# EAGLE design DCCInterface (EAGLE 9.6.2)
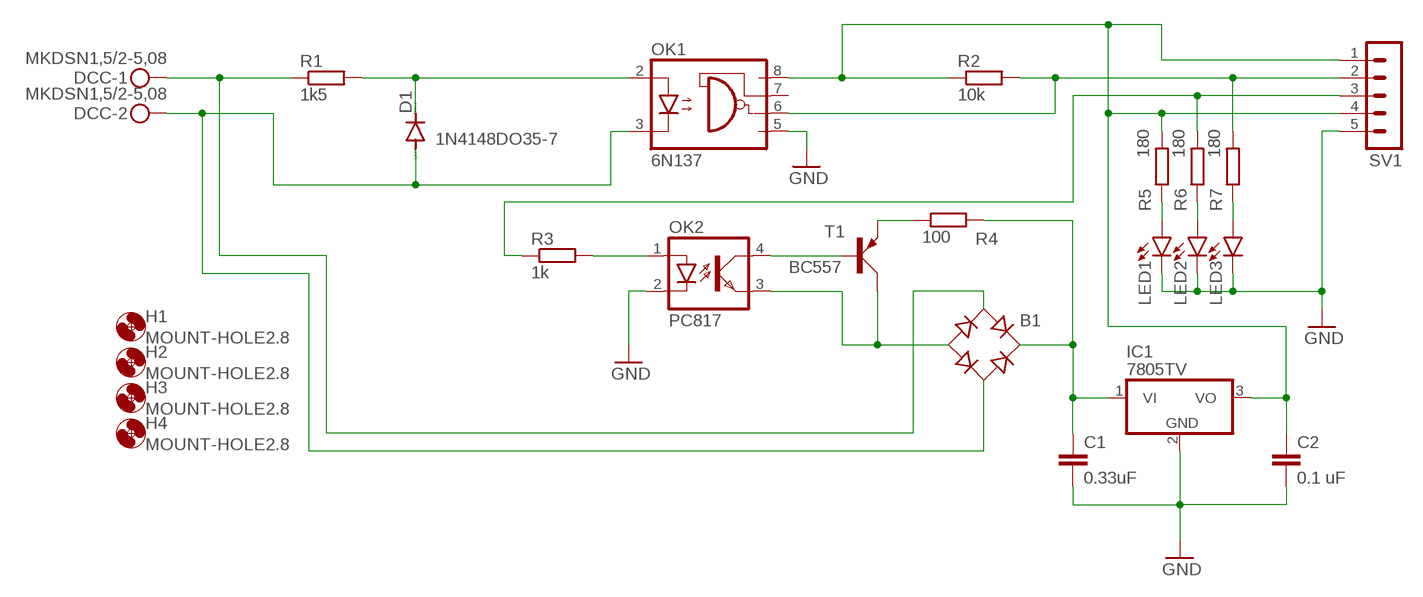
[diagram p0: schematic, sheet 1]

## Parts
B1  RB1A  [RB1A]
C1  0.33uF  C-EU025-025X050  [C025-025X050]
C2  0.1 uF  C-EU025-025X050  [C025-025X050]
D1  1N4148DO35-7  [DO35-7]
DCC  MKDSN1,5/2-5,08  [MKDSN1,5/2-5,08]
H1  MOUNT-HOLE2.8  [2,8]
H2  MOUNT-HOLE2.8  [2,8]
H3  MOUNT-HOLE2.8  [2,8]
H4  MOUNT-HOLE2.8  [2,8]
IC1  7805TV  [TO220V]
LED1  LED3MM  [LED3MM]
LED2  LED3MM  [LED3MM]
LED3  LED3MM  [LED3MM]
OK1  6N137  [DIL08]
OK2  PC817  [DIL04]
R1  1k5  R-EU_0204/7  [0204/7]
R2  10k  R-EU_0204/7  [0204/7]
R3  1k  R-EU_0204/7  [0204/7]
R4  100  R-EU_0204/7  [0204/7]
R5  180  R-EU_0204/7  [0204/7]
R6  180  R-EU_0204/7  [0204/7]
R7  180  R-EU_0204/7  [0204/7]
SV1  MA05-1  [MA05-1]
T1  BC557  [SOT54A]

## Nets
GND: C1.2 C2.2 IC1.2(GND) LED1.K(C) LED2.K(C) LED3.K(C) OK1.5(GND) OK2.2(C) SV1.5
N$1: LED1.A R5.1
N$2: C2.1 IC1.3(VO) OK1.8(VCC) R2.1 R5.2 SV1.1 SV1.4
N$3: D1.C OK1.2(A) R1.2
N$4: LED2.A R6.1
N$5: OK1.6(VO) R2.2 R7.2 SV1.2
N$6: B1.AC1 DCC.1 R1.1
N$7: OK2.1(A) R3.2
N$8: OK2.4(COL) T1.B
N$9: B1.+ C1.1 IC1.1(VI) R4.2
N$10: B1.- OK2.3(EMIT) T1.C
N$11: R4.1 T1.E
N$12: R3.1 R6.2 SV1.3
N$13: B1.AC2 D1.A DCC.2 OK1.3(C)
N$14: LED3.A R7.1
Unconnected: OK1.7(VE)

## Library data of the parts
B1 = rectifier:RB1A: RECTIFIER 1 A
C1 C2 = rcl:C-EU: CAPACITOR, European symbol; SPICEPREFIX: C
D1 = diode:1N4148: DIODE high speed (Philips)
DCC = con-phoenix-508:MKDSN1,5/2-5,08: MKDSN 1,5/ 2-5,08 Printklemme Nennstrom: 13,5 A Nennspannung: 250 V Rastermaß: 5,08 mm Polzahl: 2 Anschlussart: Schraubanschluss Montage: Löten Anschlussrichtung Leiter/Platine: 0 ° Artikelnummer: 1729128 Source: http://eshop.phoenixcontact.com .. 1729128.pdf
H1-H4 = holes:MOUNT-HOLE: MOUNTING HOLE with drill center marker
IC1 = linear:78*: Positive VOLTAGE REGULATOR Source: http://cache.national.com/ds/LM/LM78L05.pdf http://www.fairchildsemi.com/ds/LM/LM7805.pdf
LED1-LED3 = led:LED: LED OSRAM: - CHIPLED LG R971, LG N971, LY N971, LG Q971, LY Q971, LO R971, LY R971 LH N974, LH R974 LS Q976, LO Q976, LY Q976 LO Q996 - Hyper CHIPLED LW Q18S LB Q993, LB Q99A, LB R99A - SideLED LS A670, LO A670, LY A670, LG A670, LP A670 LB A673, LV A673, LT A673, LW A673 LH A674 LY A675 LS A676, LA A676, LO A676, LY A676, LW A676 LS A679, LY A679, LG A679 - Hyper Micro SIDELED® LS Y876, LA Y876, LO Y876, LY Y876 LT Y87S - SmartLED LW L88C, LW L88S LB L89C, LB L89S, LG L890 LS L89K, LO L89K, LY L89K LS L896, LA L896, LO L896, LY L896 - TOPLED LS T670, LO T670, LY T670, LG T670, LP T670 LSG T670, LSP T670, LSY T670, LOP T670, LYG T670 LG T671, LOG T671, LSG T671 LB T673, LV T673, LT T673, LW T673 LH T674 LS T676, LA T676, LO T676, LY T676, LB T676, LH T676, LSB T676, LW T676 LB T67C, LV T67C, LT T67C, LS T67K, LO T67K, LY T67K, LW E67C LS E67B, LA E67B, LO E67B, LY E67B, LB E67C, LV E67C, LT E67C LW T67C LS T679, LY T679, LG T679 LS T770, LO T770, LY T770, LG T770, LP T770 LB T773, LV T773, LT T773, LW T773 LH T774 LS E675, LA E675, LY E675, LS T675 LS T776, LA T776, LO T776, LY T776, LB T776 LHGB T686 LT T68C, LB T68C - Hyper Mini TOPLED® LB M676 - Mini TOPLED Santana® LG M470 LS M47K, LO M47K, LY M47K Source: http://www.osram.convergy.de LUXEON: - LUMILED® LXK2-PW12-R00, LXK2-PW12-S00, LXK2-PW14-U00, LXK2-PW14-V00 LXK2-PM12-R00, LXK2-PM12-S00, LXK2-PM14-U00 LXK2-PE12-Q00, LXK2-PE12-R00, LXK2-PE12-S00, LXK2-PE14-T00, LXK2-PE14-U00 LXK2-PB12-K00, LXK2-PB12-L00, LXK2-PB12-M00, LXK2-PB14-N00, LXK2-PB14-P00, LXK2-PB14-Q00 LXK2-PR12-L00, LXK2-PR12-M00, LXK2-PR14-Q00, LXK2-PR14-R00 LXK2-PD12-Q00, LXK2-PD12-R00, LXK2-PD12-S00 LXK2-PH12-R00, LXK2-PH12-S00 LXK2-PL12-P00, LXK2-PL12-Q00, LXK2-PL12-R00 Source: www.luxeon.com KINGBRIGHT: KA-3528ASYC Source: www.kingbright.com
OK1 = optocoupler:6N137: MOTOROLA OPTO COUPLER; MPN: 6N137; OC_FARNELL: 1328376; OC_NEWARK: 52M1895
OK2 = optocoupler:PC817: SHARP OPTO COUPLER; MPN: PC817X4J000F; OC_FARNELL: 9707727; OC_NEWARK: 97K7059
R1-R7 = rcl:R-EU_: RESISTOR, European symbol; SPICEPREFIX: R
SV1 = con-lstb:MA05-1: PIN HEADER; OC_FARNELL: unknown; OC_NEWARK: unknown
T1 = transistor-small-signal:BC557: PNP TRANSISTOR

## Board
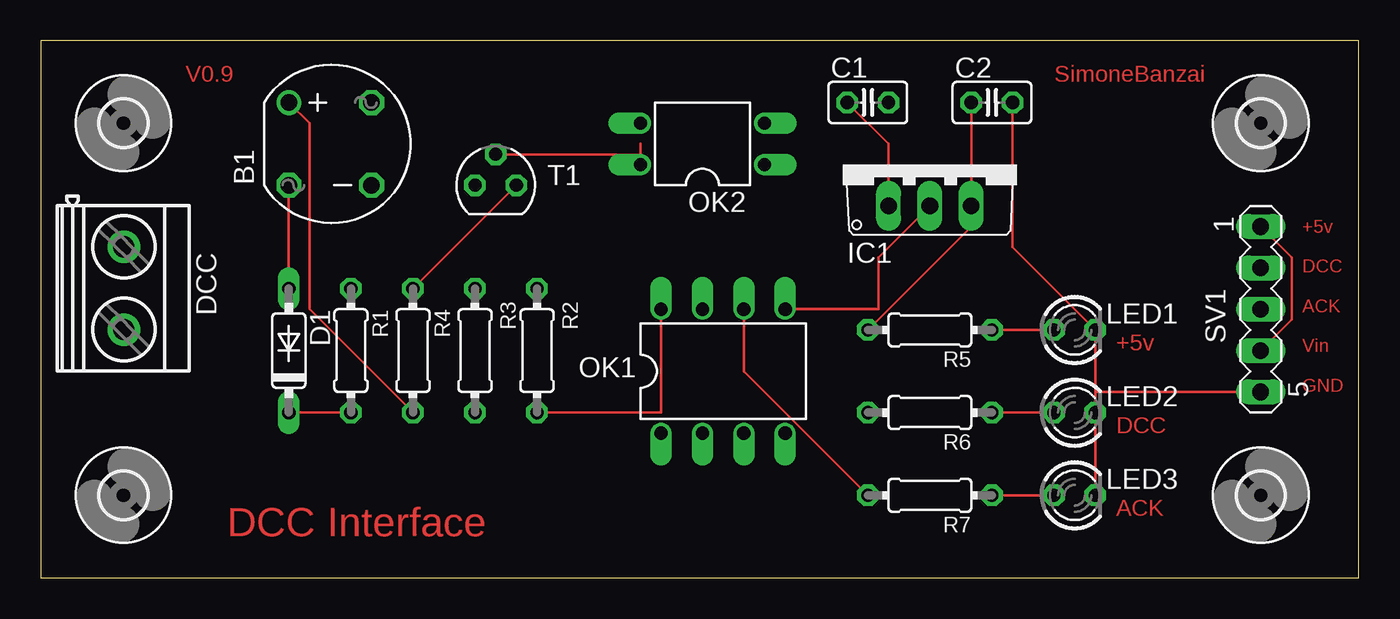
[diagram p1: board, top side]
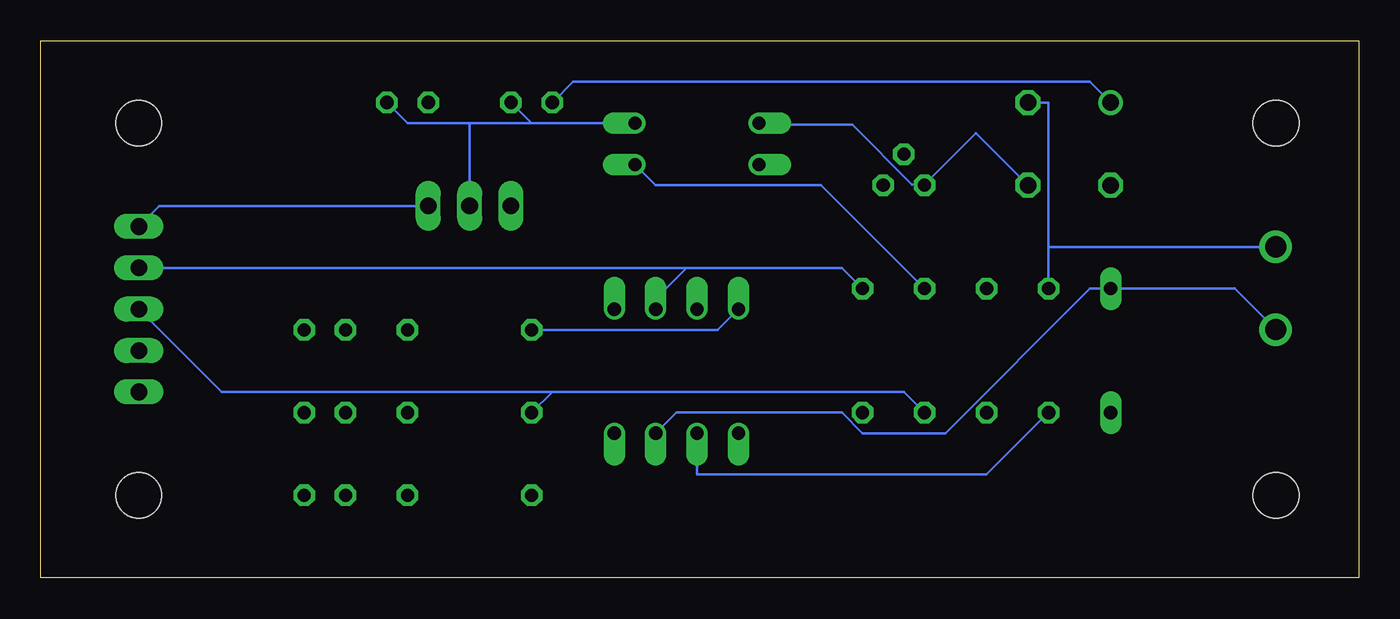
[diagram p2: board, bottom side, seen from below]

Size 80.95 x 33.01 mm. Coordinates in mm from the lower left corner, seen from the top.
Outline: 0,0 80.95,0 80.95,33.01 0,33.01 0,0
Copper layers (1*16): Top 0.035mm / dielectric 1.5mm / Bottom 0.035mm
Design rules "default": minimum track width 6mil, minimum drill 0.35mm, track to track 6mil, track to pad 6mil, pad to pad 6mil, via to via 6mil, smd to smd 6mil, copper to edge 40mil, drill to drill 6mil, minimum pad ring 10mil, minimum via ring 8mil, stop-mask expansion 4mil, vias tented up to drill 0mil, thermal gap 10mil

### Footprints (pad centres in the part's own frame; a part is rotated, then mirrored left to right if it is on the bottom)
RB1A = drill 1.016: + -2.54,2.54 | drill 1.016 octagon: - 2.54,-2.54; AC1 2.54,2.54; AC2 -2.54,-2.54
C025-025X050 = drill 0.813 octagon: 1 -1.27,0; 2 1.27,0
DO35-7 = drill 0.813 long: A 3.81,0; C -3.81,0
MKDSN1,5/2-5,08 = drill 1.3 pad 2: 1 -2.561,0.025; 2 2.519,0.025
2,8 = hole 2.8: 0,0
TO220V = drill 1.016 long: 1 -2.54,-2.54; 2 0,-2.54; 3 2.54,-2.54
LED3MM = drill 0.813 octagon: A -1.27,0; K 1.27,0
DIL08 = drill 0.813 offset: 1 -3.81,-3.81; 2 -1.27,-3.81; 3 1.27,-3.81; 4 3.81,-3.81; 5 3.81,3.81; 6 1.27,3.81; 7 -1.27,3.81; 8 -3.81,3.81
DIL04 = drill 0.813 offset: 1 -1.27,-3.81; 2 1.27,-3.81; 3 1.27,3.81; 4 -1.27,3.81
0204/7 = drill 0.813 octagon: 1 -3.81,0; 2 3.81,0
MA05-1 = drill 1.016 long: 1 -5.08,0; 2 -2.54,0; 3 0,0; 4 2.54,0; 5 5.08,0
SOT54A = drill 0.813 octagon: B 0,1.905; C -1.27,0; E 1.27,0

### Placement (x,y rotation side)
B1  17.78,26.67 0 top
C1  50.8,29.21 0 top
C2  58.42,29.21 0 top
D1  15.24,13.97 90 top
DCC  5.08,17.78 270 top
H1  74.93,5.08 0 top
H2  5.08,5.08 0 top
H3  5.08,27.94 0 top
H4  74.93,27.94 0 top
IC1  54.61,25.4 0 top
LED1  63.5,15.24 0 top
LED2  63.5,10.16 0 top
LED3  63.5,5.08 0 top
OK1  41.91,12.7 0 top
OK2  40.64,26.67 90 top
R1  19.05,13.97 270 top
R2  30.48,13.97 90 top
R3  26.67,13.97 90 top
R4  22.86,13.97 270 top
R5  54.61,15.24 180 top
R6  54.61,10.16 180 top
R7  54.61,5.08 180 top
SV1  74.93,16.51 270 top
T1  27.94,24.13 0 top

### Tracks (layer width: path | path; a pad name or v marks a point on that pad's centre or on a via)
GND
  Top 0.152: LED3.K LED2.K 64.77,11.43 | 64.77,11.43 LED1.K 59.69,20.32 C2.2 | 64.77,11.43 SV1.5 | OK1.5 51.44,16.51 51.44,19.68 IC1.2
  Bottom 0.152: 50.8,27.94 OK2.2 | C1.2 50.8,27.94 | C2.2 58.42,27.94 54.61,27.94 | 50.8,27.94 54.61,27.94 | 54.61,27.94 IC1.2
N$1
  Top 0.152: LED1.A R5.1
N$2
  Top 0.152: R2.1 38.1,10.16 OK1.8 | SV1.4 76.83,15.88 76.83,19.68 SV1.1 | R5.2 57.15,21.59 IC1.3 C2.1
  Bottom 0.152: SV1.1 73.66,22.86 IC1.3 | OK1.8 39.37,15.24 R5.2
N$3
  Top 0.152: R1.2 D1.C
  Bottom 0.152: OK1.2 40.64,6.35 22.86,6.35 R1.2
N$4
  Top 0.152: LED2.A R6.1
N$5
  Top 0.152: R7.2 43.18,12.7 OK1.6
  Bottom 0.152: R2.2 31.75,19.05 41.27,19.05 | 41.27,19.05 43.18,17.15 OK1.6 | 41.27,19.05 SV1.2
N$6
  Bottom 0.152: 19.05,20.32 19.05,29.21 B1.AC1 | 19.05,20.32 R1.1 | 19.05,20.32 5.71,20.32 DCC.1
N$7
  Bottom 0.152: R3.2 33.02,24.13 43.18,24.13 OK2.1
N$8
  Top 0.152: 36.83,26.67 OK2.4 36.88,26.01 28.04,26.01 T1.B
N$9
  Top 0.152: C1.1 52.07,26.67 IC1.1 | R4.2 16.51,16.51 16.51,27.94 B1.+
  Bottom 0.152: C1.1 48.26,30.48 16.51,30.48 B1.+
N$10
  Bottom 0.152: B1.- 23.52,27.33 26.67,24.18 | 26.67,24.18 27.43,24.18 31.09,27.84 36.73,27.84 OK2.3 | 26.67,24.18 T1.C
N$11
  Top 0.152: T1.E R4.1
N$12
  Bottom 0.152: R3.1 27.94,11.43 49.53,11.43 | R6.2 49.53,11.43 | SV1.3 69.85,11.43 49.53,11.43
N$13
  Top 0.152: D1.A B1.AC2
  Bottom 0.152: OK1.3 41.91,10.16 31.75,10.16 30.48,8.89 25.4,8.89 16.51,17.78 D1.A 7.62,17.78 5.71,15.88 DCC.2
N$14
  Top 0.152: LED3.A R7.1

### Text on the board
Top: V0.9 | SimoneBanzai | +5v | +5v / / DCC / / ACK / / Vin / / GND | DCC | ACK | DCC Interface